# Altium project PK_PCB_Projekt.PrjPCB
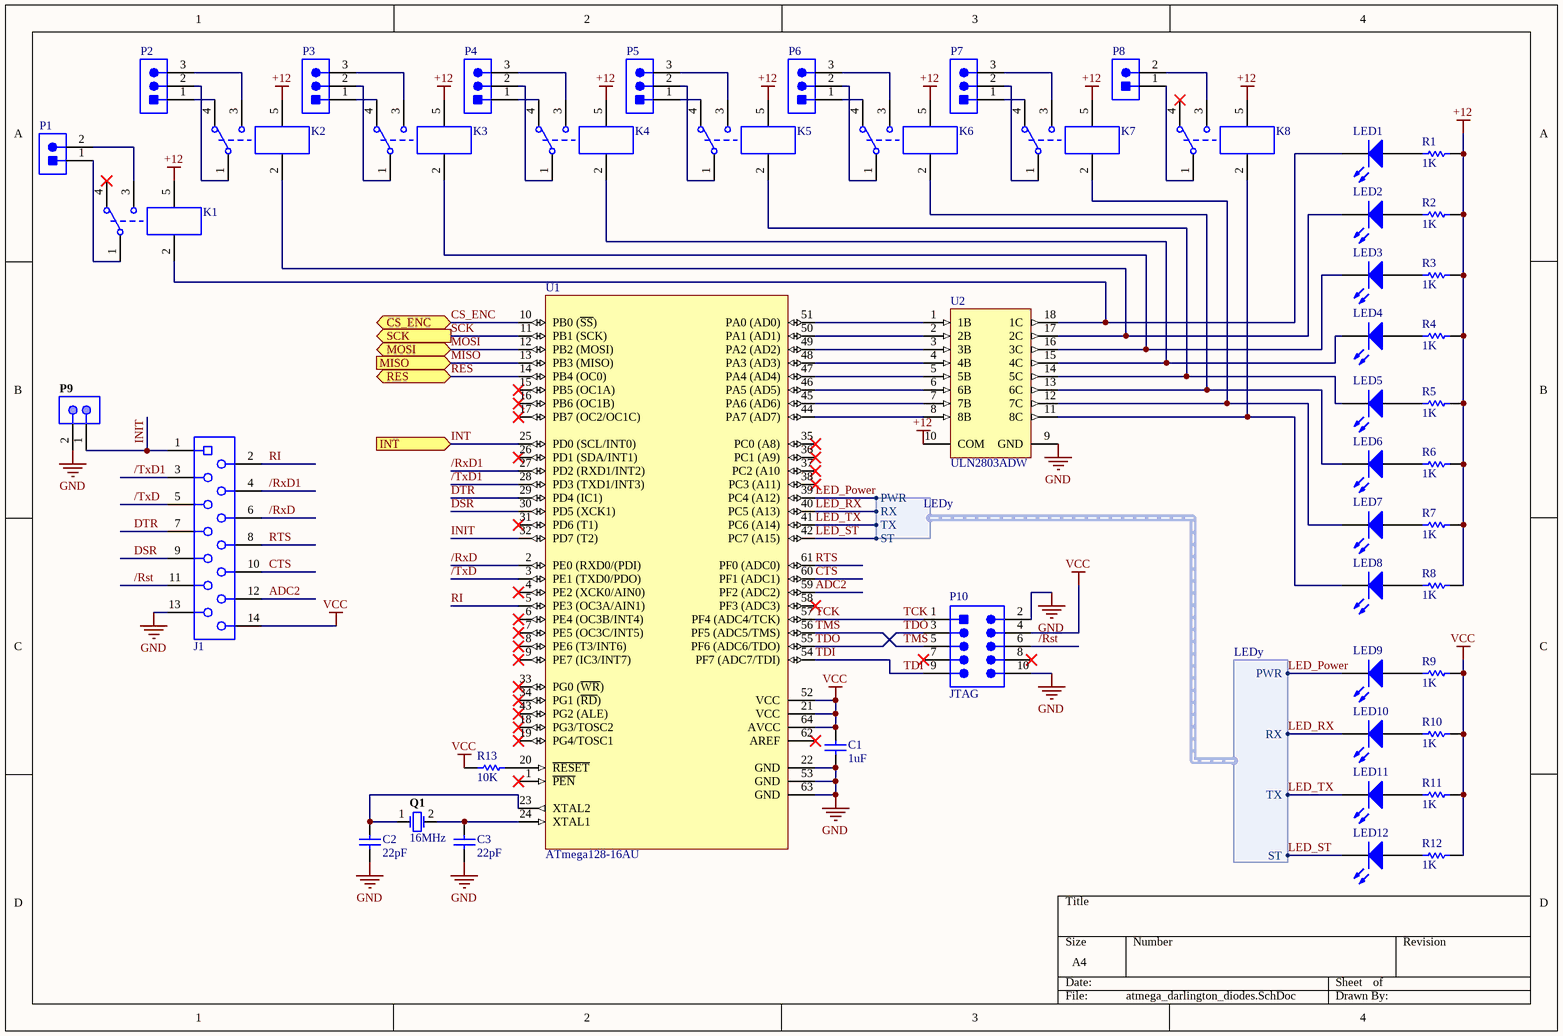
[diagram p0: atmega_darlington_diodes.SchDoc]
2 sheets, 84 parts. Net scope: flat (ports and power ports of the same name join across sheets).
Board file: PCB1.PcbDoc
Sheets:
  atmega_darlington_diodes.SchDoc
  ethernet_zasilanie.SchDoc

## Sheet atmega_darlington_diodes.SchDoc
size A4

### Parts
C1  1uF  [CAPC1206(3216)130_L]
C2  22pF  [CAPC1206(3216)100_L]
C3  22pF  [CAPC1206(3216)100_L]
J1  490107671412  [490107671412]  (value not drawn)
K1  JS1-12V  [PNSC-JS1-12V_V]  (value not drawn)
K2  JS1-12V  [PNSC-JS1-12V_V]  (value not drawn)
K3  JS1-12V  [PNSC-JS1-12V_V]  (value not drawn)
K4  JS1-12V  [PNSC-JS1-12V_V]  (value not drawn)
K5  JS1-12V  [PNSC-JS1-12V_V]  (value not drawn)
K6  JS1-12V  [PNSC-JS1-12V_V]  (value not drawn)
K7  JS1-12V  [PNSC-JS1-12V_V]  (value not drawn)
K8  JS1-12V  [PNSC-JS1-12V_V]  (value not drawn)
LED1  150120YS75000  [1206_A]  (value not drawn)
LED2  150120YS75000  [1206_A]  (value not drawn)
LED3  150120YS75000  [1206_A]  (value not drawn)
LED4  150120YS75000  [1206_A]  (value not drawn)
LED5  150120YS75000  [1206_A]  (value not drawn)
LED6  150120YS75000  [1206_A]  (value not drawn)
LED7  150120YS75000  [1206_A]  (value not drawn)
LED8  150120YS75000  [1206_A]  (value not drawn)
LED9  150120BS75000  [1206_A]  (value not drawn)
LED10  150120GS75000  [1206_A]  (value not drawn)
LED11  150120YS75000  [1206_A]  (value not drawn)
LED12  150120RS75000  [1206_A]  (value not drawn)
P1  SCREW-5.0/5.08 2WAYS  [SCREW-5.0-2WAYS_V]  (value not drawn)
P2  SCREW-5.0/5.08 3WAYS  [SCREW-5.0-3WAYS_V]  (value not drawn)
P3  SCREW-5.0/5.08 3WAYS  [SCREW-5.0-3WAYS_V]  (value not drawn)
P4  SCREW-5.0/5.08 3WAYS  [SCREW-5.0-3WAYS_V]  (value not drawn)
P5  SCREW-5.0/5.08 3WAYS  [SCREW-5.0-3WAYS_V]  (value not drawn)
P6  SCREW-5.0/5.08 3WAYS  [SCREW-5.0-3WAYS_V]  (value not drawn)
P7  SCREW-5.0/5.08 3WAYS  [SCREW-5.0-3WAYS_V]  (value not drawn)
P8  SCREW-5.0/5.08 2WAYS  [SCREW-5.0-2WAYS_V]  (value not drawn)
P9  PH2541-2-SPGRH-6-3  [PH2541-2-SPGRH-6-3_V]  (value not drawn)
P10  JTAG  [3M-2510-6002_V]
Q1  16MHz  [JPY-HC-49US]
R1  1K  [RESC1206(3216)_L]
R2  1K  [RESC1206(3216)_L]
R3  1K  [RESC1206(3216)_L]
R4  1K  [RESC1206(3216)_L]
R5  1K  [RESC1206(3216)_L]
R6  1K  [RESC1206(3216)_L]
R7  1K  [RESC1206(3216)_L]
R8  1K  [RESC1206(3216)_L]
R9  1K  [RESC1206(3216)_L]
R10  1K  [RESC1206(3216)_L]
R11  1K  [RESC1206(3216)_L]
R12  1K  [RESC1206(3216)_L]
R13  10K  [RESC1206(3216)_L]
U1  ATmega128-16AU  [64A_L]
U2  ULN2803ADW  [DW0018A_L]

### Ports
CS_ENC (bidir), INT (in), MISO (in), MOSI (bidir), RES (bidir), SCK (out)

### Harnesses
LEDy: PWR, RX, TX, ST

### Nets
+12: K1.5 K2.5 K3.5 K4.5 K5.5 K6.5 K7.5 K8.5 R1.2 R2.2 R3.2 R4.2 R5.2 R6.2 R7.2 R8.2 U2.10(COM)
GND: C1.1 C2.1 C3.1 J1.13 P9.2 P10.2 P10.10 U1.22(GND) U1.53(GND) U1.63(GND) U2.9(GND)
VCC: C1.2 J1.14 P10.4 R9.2 R10.2 R11.2 R12.2 R13.1 U1.21(VCC) U1.52(VCC) U1.64(AVCC)
/Rst: J1.11 P10.6
/RxD: J1.6 U1.2(PE0_(RXD0/(PDI))
/RxD1: J1.4 U1.27(PD2_(RXD1/INT2))
/TxD: J1.5 U1.3(PE1_(TXD0/PDO))
/TxD1: J1.3 U1.28(PD3_(TXD1/INT3))
ADC2: J1.12 U1.59(PF2_(ADC2))
CS_ENC: U1.10(PB0_(~{SS})) ; port CS_ENC
CTS: J1.10 U1.60(PF1_(ADC1))
DSR: J1.9 U1.30(PD5_(XCK1))
DTR: J1.7 U1.29(PD4_(IC1))
INIT: J1.1 P9.1 U1.32(PD7_(T2))
INT: U1.25(PD0_(SCL/INT0)) ; port INT
LED_Power: LED9.1(K) U1.39(PC4_(A12)) ; harness LEDy.PWR
LED_RX: LED10.1(K) U1.40(PC5_(A13)) ; harness LEDy.RX
LED_ST: LED12.1(K) U1.42(PC7_(A15)) ; harness LEDy.ST
LED_TX: LED11.1(K) U1.41(PC6_(A14)) ; harness LEDy.TX
MISO: U1.13(PB3_(MISO)) ; port MISO
MOSI: U1.12(PB2_(MOSI)) ; port MOSI
RES: U1.14(PB4_(OC0)) ; port RES
RI: J1.2 U1.5(PE3_(OC3A/AIN1))
RTS: J1.8 U1.61(PF0_(ADC0))
SCK: U1.11(PB1_(SCK)) ; port SCK
TCK: P10.1 U1.57(PF4_(ADC4/TCK))
TDI: P10.9 U1.54(PF7_(ADC7/TDI))
TDO: P10.3 U1.55(PF6_(ADC6/TDO))
TMS: P10.5 U1.56(PF5_(ADC5/TMS))
NetC2_2: C2.2 Q1.1 U1.23(XTAL2)
NetC3_2: C3.2 Q1.2 U1.24(XTAL1)
NetK1_1: K1.1(COM) P1.1
NetK1_2: K1.2 LED1.1(K) U2.18(1C)
NetK1_3: K1.3(N.O.) P1.2
NetK2_1: K2.1(COM) P2.2
NetK2_2: K2.2 LED2.1(K) U2.17(2C)
NetK2_3: K2.3(N.O.) P2.3
NetK2_4: K2.4(N.C.) P2.1
NetK3_1: K3.1(COM) P3.2
NetK3_2: K3.2 LED3.1(K) U2.16(3C)
NetK3_3: K3.3(N.O.) P3.3
NetK3_4: K3.4(N.C.) P3.1
NetK4_1: K4.1(COM) P4.2
NetK4_2: K4.2 LED4.1(K) U2.15(4C)
NetK4_3: K4.3(N.O.) P4.3
NetK4_4: K4.4(N.C.) P4.1
NetK5_1: K5.1(COM) P5.2
NetK5_2: K5.2 LED5.1(K) U2.14(5C)
NetK5_3: K5.3(N.O.) P5.3
NetK5_4: K5.4(N.C.) P5.1
NetK6_1: K6.1(COM) P6.2
NetK6_2: K6.2 LED6.1(K) U2.13(6C)
NetK6_3: K6.3(N.O.) P6.3
NetK6_4: K6.4(N.C.) P6.1
NetK7_1: K7.1(COM) P7.2
NetK7_2: K7.2 LED7.1(K) U2.12(7C)
NetK7_3: K7.3(N.O.) P7.3
NetK7_4: K7.4(N.C.) P7.1
NetK8_1: K8.1(COM) P8.1
NetK8_2: K8.2 LED8.1(K) U2.11(8C)
NetK8_3: K8.3(N.O.) P8.2
NetLED1_2: LED1.2(A) R1.1
NetLED2_2: LED2.2(A) R2.1
NetLED3_2: LED3.2(A) R3.1
NetLED4_2: LED4.2(A) R4.1
NetLED5_2: LED5.2(A) R5.1
NetLED6_2: LED6.2(A) R6.1
NetLED7_2: LED7.2(A) R7.1
NetLED8_2: LED8.2(A) R8.1
NetLED9_2: LED9.2(A) R9.1
NetLED10_2: LED10.2(A) R10.1
NetLED11_2: LED11.2(A) R11.1
NetLED12_2: LED12.2(A) R12.1
NetR13_2: R13.2 U1.20(~{RESET})
NetU1_44: U1.44(PA7_(AD7)) U2.8(8B)
NetU1_45: U1.45(PA6_(AD6)) U2.7(7B)
NetU1_46: U1.46(PA5_(AD5)) U2.6(6B)
NetU1_47: U1.47(PA4_(AD4)) U2.5(5B)
NetU1_48: U1.48(PA3_(AD3)) U2.4(4B)
NetU1_49: U1.49(PA2_(AD2)) U2.3(3B)
NetU1_50: U1.50(PA1_(AD1)) U2.2(2B)
NetU1_51: U1.51(PA0_(AD0)) U2.1(1B)

Not connected (* = marked no-connect by the designer): K1 4(N.C.)*; K8 4(N.C.)*; P10 7* 8*; U1 1(~{PEN})* 4(PE2_(XCK0/AIN0))* 6(PE4_(OC3B/INT4))* 7(PE5_(OC3C/INT5))* 8(PE6_(T3/INT6))* 9(PE7_(IC3/INT7))* 15(PB5_(OC1A))* 16(PB6_(OC1B))* 17(PB7_(OC2/OC1C))* 18(PG3/TOSC2)* 19(PG4/TOSC1)* 26(PD1_(SDA/INT1))* 31(PD6_(T1))* 33(PG0_(~{WR}))* 34(PG1_(~{RD}))* 35(PC0_(A8))* 36(PC1_(A9))* 37(PC2_(A10)* 38(PC3_(A11))* 43(PG2_(ALE))* 58(PF3_(ADC3))* 62(AREF)*

### Library data of the parts
C1 = CMP-1037-04671-1: CAP 1uF 10V ±5% 1206 (3216 Metric) Thickness 1.3mm SMD; Case-EIA: 1206; Tolerance: Â±5%; Case-Metric: 3216; Value: 1uF; Technology: SMT; Rated Voltage: 10 V; Max Thickness: 1.3 mm
C2 C3 = CMP-1037-00952-1: CAP 22pF 10V ±0.25pF 1206 (3216 Metric) Thickness 1mm SMD; Tolerance: Â±0.25pF; Case-EIA: 1206; Case-Metric: 3216; Rated Voltage: 10 V; Technology: SMT; Max Thickness: 1 mm; Value: 22pF
J1 = CMP-1502-02453-1: REDFIT IDC SKEDD Connector WR-WST, pitch 2.54 mm, 14 pins; Manufacturer: Wurth Elektronik; Pin Number: 14; Pitch: 2.54mm; Contact Resistance: 10mOhm; Rated Current: 1A; Working Voltage: 500VAC; PCB Thickness: 1.6mm; Part Number: 490107671412; Package Reference: 490107671412; Operating Temperature: -25to105degC; Publisher: WurthElektronik; Manufacturer URL: http://www.we-online.de; Packaging: Tube; Mounting Technology: Plug-in; Datasheet URL: https://katalog.we-online.de/em/datasheet/490107671412.pdf
K1-K8 = CMP-2000-06502-1: Cubic Type 1C Power Relay, SPDT, 10 A, 12 V, -40 to 70 degC, 5-Pin THD, RoHS, Bulk; Manufacturer: Panasonic; Material, contact: Silveralloy; Current, switch max: 10A; External Width: 22mm; Contact Voltage DC Nom: 100V; Power, coil DC: 360mW; Coil operating upper percent limit: 130%; Coil Resistance: 400ohm; Relay Mounting: ThroughHole; Coil Type: DC; External Height: 16mm; Coil Current: 30mA; Resistance, coil: 400R; Approval Bodies: UL&CSA,TUV; Voltage, switching AC/DC min: 277Vac; Voltage, contact AC max: 125V; Time, operating: 10ms; Current, contact min: 6A@277Vac; Coil Voltage VDC Nom: 12V; Configuration, contact: SPCO; Contact Voltage AC Nom: 277V; Temperature, operating (a) max: 70°C; Temperature, operating (a) min: -40°C; Coil operating lower percent limit: 70%; Width, external: 16.4mm; Current, contact AC max: 10A; Relay Type: Power; External Depth: 22mm; Package Reference: JS1-12V; Mounting Technology: ThroughHole; Diameter, PCB hole: 1.3mm; Depth, external: 16.4mm; Length / Height, external: 22mm; Nom Operating Power: 360mW; Time, release: 10ms; Datasheet URL: https://www3.panasonic.biz/ac/e_download/control/relay/power/catalog/mech_eng_js.pdf; Voltage, coil DC nom: 12V; Contact Current Max: 10A; Manufacturer URL: http://www.panasonic.com/; Contact Configuration: SPDT; Package Description: 5-Pin Through Hole Device, Body 22 x 16 mm; Datasheet Version: 12/2016
LED1-LED8 LED11 = CMP-1426-00019-1: SMD mono-color Chip LED, WL-SMCW, Yellow; Manufacturer: Wuerth Elektronik; ComponentLink2URL: http://katalog.we-online.com/led/datasheet/150120YS75000.pdf; PartNumber: 150120YS75000; ComponentLink1URL: http://www.we-online.com; Color: Yellow; ComponentLink1Description: Manufacturer URL; PackageReference: 1206_A; ComponentLink2Description: Datasheet
LED9 = CMP-1426-00015-1: SMD mono-color Chip LED, WL-SMCW, Blue; Manufacturer: Wuerth Elektronik; ComponentLink2Description: Datasheet; ComponentLink1URL: http://www.we-online.com; PartNumber: 150120BS75000; ComponentLink1Description: Manufacturer URL; ComponentLink2URL: http://katalog.we-online.com/led/datasheet/150120BS75000.pdf; PackageReference: 1206_A; Color: Blue
LED10 = CMP-1426-00014-1: SMD mono-color Chip LED, WL-SMCW, Green; Manufacturer: Wuerth Elektronik; PackageReference: 1206_A; PartNumber: 150120GS75000; ComponentLink1Description: Manufacturer URL; ComponentLink2URL: http://katalog.we-online.com/led/datasheet/150120GS75000.pdf; ComponentLink2Description: Datasheet; Color: Green; ComponentLink1URL: http://www.we-online.com
LED12 = CMP-1426-00013-1: SMD mono-color Chip LED, WL-SMCW, Red; Manufacturer: Wuerth Elektronik; Color: Red; ComponentLink2URL: http://katalog.we-online.com/led/datasheet/150120RS75000.pdf; ComponentLink2Description: Datasheet; ComponentLink1Description: Manufacturer URL; ComponentLink1URL: http://www.we-online.com; PartNumber: 150120RS75000; PackageReference: 1206_A
P1 P8 = CMP-0617-00009-1: Socket, Screw Terminal Block, 2 Way, 5.0 mm Pitch, 90 Degree Angle, Through-Hole; Manufacturer: No Vendor; Insulation Resistance: 5000 MOhm / 1000 V; Contact Resistance: 20 mOhm; Rated Current: 25 A; Poles: 2; Rated Voltage: 300 V; PartNumber: SCREW-5.0/5.08 2WAYS; ComponentLink1Description: Datasheet; ComponentLink1URL: 5mm screw terminal in SVN; Mounting Technology: Through Hole; PackageDescription: Socket, Screw Terminal Block, 2 Way, Pitch 5 mm, 90 Degree Angle, Through-Hole; Temperature Range: -40 to 105 degC
P2-P7 = CMP-0617-00010-1: Socket, Screw Terminal Block, 3 Way, 5.0 mm Pitch, 90 Degree Angle, Through-Hole; Manufacturer: No Vendor; Insulation Resistance: 5000 MOhm / 1000 V; Rated Voltage: 300 V; Poles: 3; Contact Resistance: 20 mOhm; Rated Current: 25 A; PartNumber: SCREW-5.0/5.08 3WAYS; PackageDescription: Socket, Screw Terminal Block, 3 Way, Pitch 5 mm, 90 Degree Angle, Through-Hole; Temperature Range: -40 to 105 degC; ComponentLink1Description: Datasheet; ComponentLink1URL: 5mm screw terminal in SVN; Mounting Technology: Through Hole
P9 = CMP-0261-00001-1: Male Header, Pitch 2.54mm, 2x1 Position, Mated Height 6mm, Tail Length 3mm; PackageDescription: 2-Pin Male Header IDC, 2.54 x 5.08 mm Body, 2.54 mm Pitch; PartNumber: PH2541-2-SPGRH-6-3; ComponentLink1URL: http://www.suzhoupinchao.com/; Mounting Technology: Through Hole; ComponentLink1Description: Manufacturer URL; PackageReference: PH2541-2-SPGRH-6-3
P10 = CMP-2000-05545-1: Male Header, Pitch 2.54 mm, 2 x 5 Position, Height 9.91 mm, Tail Length 2.84 mm, -55 to 105 degC, RoHS, Bulk; Manufacturer: 3M; Associated Product: 3505-33(1000BX)-ND / -CONNEJECTORLATCHLONGSNAP-IN; Pitch: 0.100"(2.54mm); Catalog Drawings: 6002UB,RBSeries; Dynamic Catalog: 2500Series; Connector Type: Header,Shrouded; Other Names: 5400782713 / 54007827139 / 80-6105-6503-0 / 80610565030 / MHB10G / MHB10K; Product Training Modules: IDCWiremountConnectorsPrimer; Number of Positions Loaded: All; Mating Products: CHG-2010-S01010-KEP-ND / -CONNRCPTIDC10POS24-22AWG / 3M11964-ND / -CONNSOCKET10POSIDCW/STRREL / 89110-0003-ND / -CONNSOCKET10POSIDCW/STRREL / 5110-B7A2PL-ND / -10/2R/BMSKT/.100 / MKC10E-ND / -CONN10POSIDCSOCKET10AUW/POL / MSC10E-ND / -CONN10POSIDCSOCKET15GOLD / D89110-0101HK-ND / -CONN10POSIDCSOCKETGOLDW/POL / D89110-0001HK-ND / -CONN10POSIDCSOCKETGOLD / MSPV10-ND / -CONNSOCKETPCBVERT10POS.1" / 3M9088-ND / -CONNRECEPTIDC10POS24-22AWG / More...; Number of Positions: 10; Category: Connectors,Interconnects; Datasheet Version: Rev. M, 08/2014; Datasheet URL: http://multimedia.3m.com/mws/media/330367O/3mtm-100-in-4-wall-hdr-rohs-lp-straightra-hitemp-ts0770.pdf; Series: 2500; Contact Finish: Gold; Number of Rows: 2; Standard Package: 784; Color: Gray; Package Description: Male Header, Pitch 2.54 mm, 2 x 5 Position, Height 9.91 mm, Tail Length 2.84 mm; Packaging: Bulk; Contact Type: MalePin; Mounting Technology: ThroughHole; Family: RectangularConnectors-Headers,MalePins; Contact Mating Length: 0.243"(6.17mm); Termination: Solder; Row Spacing: 0.100"(2.54mm); Package Reference: 2510-6002; Contact Finish Thickness: 30µin(0.76µm); Mounting Type: ThroughHole; Manufacturer URL: http://www.3m.com/
Q1 = CMP-2100-03645-1: Crystal, 16 MHz, +/- 30 ppm, 18 pF, -20 to 70 degC, 2-Pin THD; Manufacturer: Jing peng yuan; Datasheet URL: https://statics3.seeedstudio.com/images/opl/datasheet/306010014.pdf; Package Description: 2-Pin Throug Hole Device, Body 11.05 x 4.65 mm, Pitch 4.9 mm; Datasheet Version: 42125.0; Package Reference: HC-49US
R1-R12 = CMP-1014-00510-1: 1K 0.25W 1% 1206 (3216 Metric)  SMD; Case-Metric: 3216; Case-EIA: 1206; Value: 1000.00 Ohm; Power: 0.25 W; Tolerance: 1 %; Technology: SMT
R13 = CMP-1014-00623-1: 10K 0.25W 1% 1206 (3216 Metric)  SMD; Case-Metric: 3216; Value: 10000.00 Ohm; Case-EIA: 1206; Power: 0.25 W; Technology: SMT; Tolerance: 1 %
U1 = CMP-0095-00653-1: 8-bit AVR Microcontroller, 4.5-5.5V, 128KB Flash, 4KB EEPROM, 4KB SRAM, 64-pin TQFP, Industrial Grade (-40°C to 85°C), Reel; ComponentLink2URL: http://www.atmel.com/dyn/resources/prod_documents/doc2467.pdf; PackageVersion: revC, Oct-2010; ComponentLink3Description: ATmega128(L) Summary; PackageDescription: 64-Pin Plastic Thin Profile Quad Flat Pack, 14 x 14 x 1.0 mm Body, 0.8 mm Pitch (TQFP); ComponentLink1URL: http://www.atmel.com/; PackageReference: 64A; ComponentLink1Description: Manufacturer URL; DatasheetVersion: revX, Jun-2011; ComponentLink3URL: http://www.atmel.com/dyn/resources/prod_documents/2467S.pdf; ComponentLink2Description: ATmega128(L) Datasheet; Code_JEDEC: MS-026-AEB
U2 = CMP-2000-07353-1: Darlington Transistor NPN, 50 V, 0.5 A, -40 to 85 degC, 18-Pin SOIC (DW), Green (RoHS & no Sb/Br), Tube; Manufacturer: Texas Instruments; Base Number: 2803; Package Version: 4040000-3/G, 01/2011; SVHC: NoSVHC(19-Dec-2012); Module Configuration: Eight; No. of Pins: 18; No. of Transistors: 8; Current Ic Continuous a Max: 500mA; Collector Emitter Voltage V(br)ceo: 50V; Id: 0.5A; Datasheet URL: http://www.ti.com/lit/ds/symlink/uln2803a.pdf; Package / Case: 18-SOIC; Operating Temperature Range: -40°Cto+85°C; Manufacturer URL: http://www.ti.com/; Package Reference: DW18; DC Collector Current: 500mA; Transistor Case Style: SOIC; Transistor Polarity: NPN; Operating Temperature Min: -40°C; Device Marking: ULN2803ADW; Datasheet Version: Rev. G, 01/2015; Package URL: http://www.ti.com/lit/ml/mpds172a/mpds172a.pdf; Operating Temperature Max: 85°C; Mounting Technology: SurfaceMount; MSL: MSL2-1year; Package Description: 18-Pin Plastic Small Outline, Body 11.55 x 7.5 mm, Pitch 1.27 mm

## Sheet ethernet_zasilanie.SchDoc
size A4
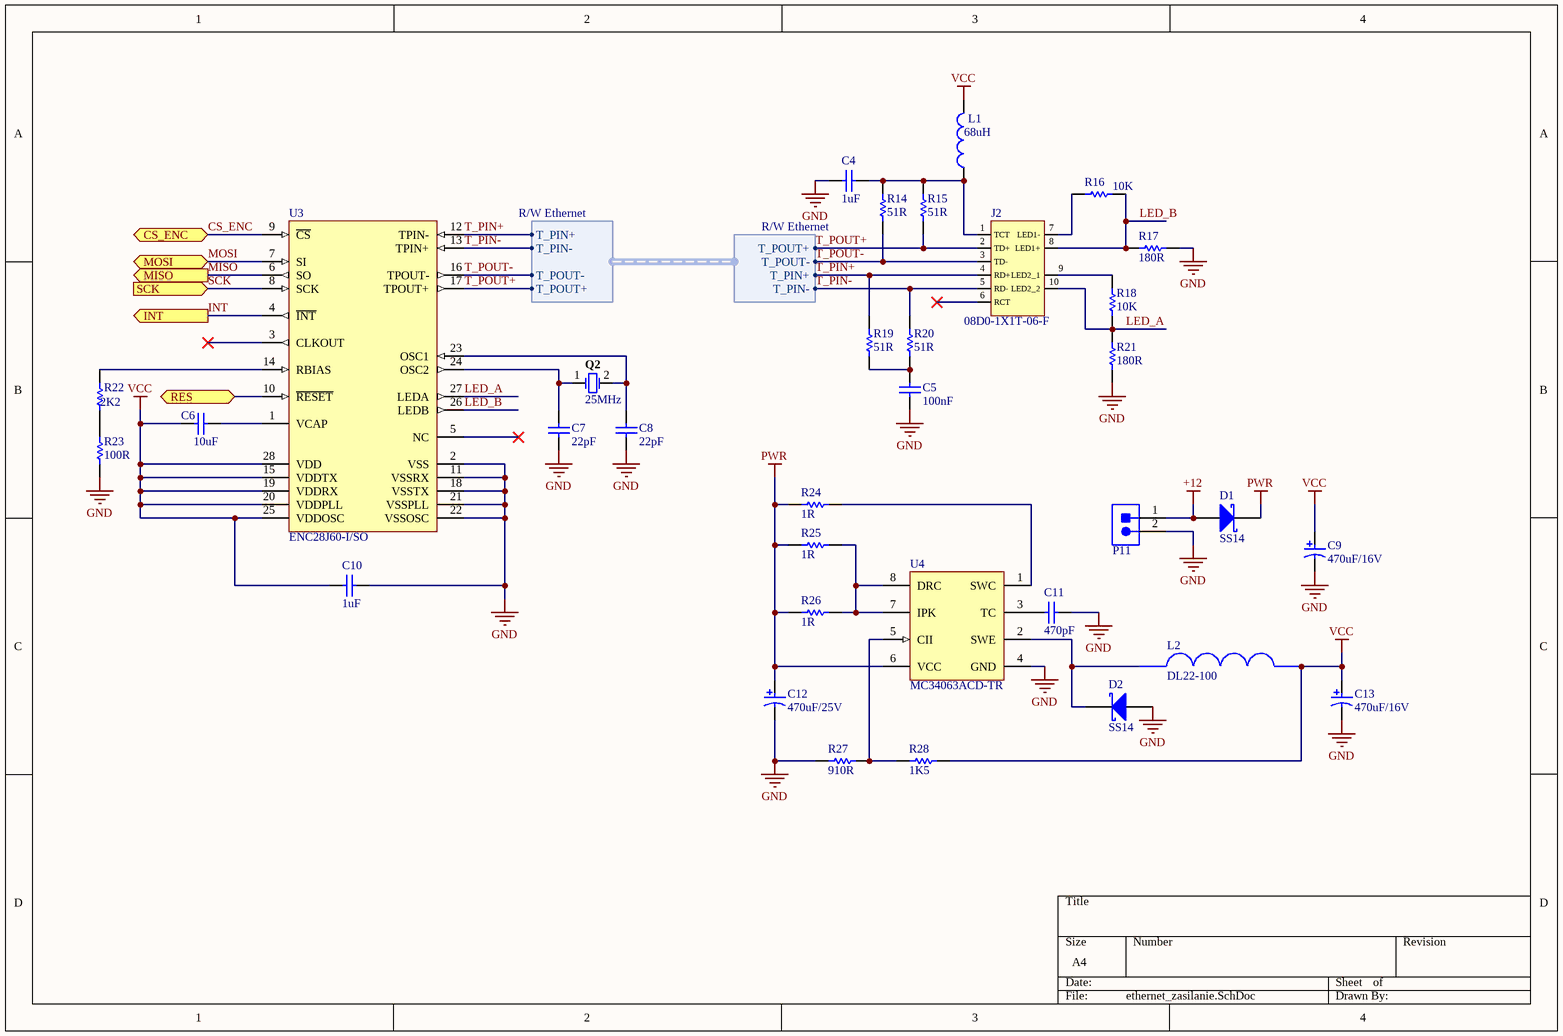
[diagram p1: ethernet_zasilanie.SchDoc]

### Parts
C4  1uF  [CAPC1206(3216)150_L]
C5  100nF  [CAPC1206(3216)190_L]
C6  10uF  [CAPC1206(3216)190_L]
C7  22pF  [CAPC1206(3216)100_L]
C8  22pF  [CAPC1206(3216)100_L]
C9  470uF/16V  [PNSC-FK-V-F_V]
C10  1uF  [CAPC1206(3216)130_L]
C11  470pF  [CAPC1206(3216)100_L]
C12  470uF/25V  [NIC-CAPA2-10X10_V]
C13  470uF/16V  [PNSC-FK-V-F_V]
D1  SS14  [FAIR-DO-214AC-2_V]
D2  SS14  [FAIR-DO-214AC-2_V]
J2  08D0-1X1T-06-F  [PCB_08D0-1X1T-06-F]
L1  value 68uH  [INDC1608L]  (hidden comment: Inductor)
L2  DL22-100  [DL22]
P11  SCREW-5.0/5.08 2WAYS  [SCREW-5.0-2WAYS_V]  (value not drawn)
Q2  25MHz  [JPY-HC-49US]
R14  51R  [RESC1206(3216)_L]
R15  51R  [RESC1206(3216)_L]
R16  10K  [RESC1206(3216)_L]
R17  180R  [RESC1206(3216)_L]
R18  10K  [RESC1206(3216)_L]
R19  51R  [RESC1206(3216)_L]
R20  51R  [RESC1206(3216)_L]
R21  180R  [RESC1206(3216)_L]
R22  2K2  [RESC1206(3216)_L]
R23  100R  [RESC1206(3216)_L]
R24  1R  [RESC1206(3216)_L]
R25  1R  [RESC1206(3216)_L]
R26  1R  [RESC1206(3216)_L]
R27  910R  [RESC1206(3216)_L]
R28  1K5  [RESC1206(3216)_L]
U3  ENC28J60-I/SO  [SOIC-SO28_L]
U4  MC34063ACD-TR  [SO8_L]

### Ports
CS_ENC (bidir), INT (out), MISO (out), MOSI (bidir), RES (bidir), SCK (in)

### Harnesses
R/W Ethernet: T_PIN+, T_PIN-, T_POUT-, T_POUT+
R/W Ethernet: T_POUT+, T_POUT-, T_PIN+, T_PIN-

### Nets
+12: D1.2(A) P11.1
GND: C4.1 C5.1 C7.1 C8.1 C9.2 C10.1 C11.2 C12.2 C13.2 D2.2(A) P11.2 R17.2 R21.1 R23.1 R27.1 U3.2(VSS) U3.11(VSSRX) U3.18(VSSTX) U3.21(VSSPLL) U3.22(VSSOSC) U4.4(GND)
PWR: C12.1 D1.1(K) R24.1 R25.1 R26.1 U4.6(VCC)
VCC: C6.1 C9.1 C10.2 C13.1 L1.2 L2.2 R28.2 U3.15(VDDTX) U3.19(VDDRX) U3.20(VDDPLL) U3.25(VDDOSC) U3.28(VDD)
CS_ENC: U3.9(~{CS}) ; port CS_ENC
INT: U3.4(~{INT}) ; port INT
LED_A: J2.10(LED2_2) R18.1 R21.2 U3.27(LEDA)
LED_B: J2.8(LED1+) R16.1 R17.1 U3.26(LEDB)
MISO: U3.6(SO) ; port MISO
MOSI: U3.7(SI) ; port MOSI
RES: U3.10(~{RESET}) ; port RES
SCK: U3.8(SCK) ; port SCK
T_PIN+: J2.4(RD+) R19.2 U3.12(TPIN-) ; harness R/W Ethernet.T_PIN+
T_PIN-: J2.5(RD-) R20.2 U3.13(TPIN+) ; harness R/W Ethernet.T_PIN-
T_POUT+: J2.2(TD+) R15.1 U3.17(TPOUT+) ; harness R/W Ethernet.T_POUT+
T_POUT-: J2.3(TD-) R14.1 U3.16(TPOUT-) ; harness R/W Ethernet.T_POUT-
NetC4_2: C4.2 J2.1(TCT) L1.1 R14.2 R15.2
NetC5_2: C5.2 R19.1 R20.1
NetC6_2: C6.2 U3.1(VCAP)
NetC7_2: C7.2 Q2.1 U3.24(OSC2)
NetC8_2: C8.2 Q2.2 U3.23(OSC1)
NetC11_1: C11.1 U4.3(TC)
NetD2_1: D2.1(K) L2.1 U4.2(SWE)
NetJ2_7: J2.7(LED1-) R16.2
NetJ2_9: J2.9(LED2_1) R18.2
NetR22_1: R22.1 R23.2
NetR22_2: R22.2 U3.14(RBIAS)
NetR24_2: R24.2 U4.1(SWC)
NetR25_2: R25.2 R26.2 U4.7(IPK) U4.8(DRC)
NetR27_2: R27.2 R28.1 U4.5(CII)

Not connected (* = marked no-connect by the designer): J2 6(RCT)*; U3 3(CLKOUT)* 5(NC)*

### Library data of the parts
C4 = CMP-1037-04667-1: CAP 1uF 6.3V ±5% 1206 (3216 Metric) Thickness 1.45mm SMD; Case-Metric: 3216; Tolerance: Â±5%; Case-EIA: 1206; Value: 1uF; Technology: SMT; Max Thickness: 1.45 mm; Rated Voltage: 6.3 V
C5 = CMP-1037-04169-1: CAP 100nF 10V ±1% 1206 (3216 Metric) Thickness 1.9mm SMD; Case-EIA: 1206; Tolerance: Â±1%; Case-Metric: 3216; Value: 100nF; Rated Voltage: 10 V; Max Thickness: 1.9 mm; Technology: SMT
C6 = CMP-1037-04960-1: CAP 10uF 6.3V ±5% 1206 (3216 Metric) Thickness 1.9mm SMD; Tolerance: Â±5%; Case-EIA: 1206; Case-Metric: 3216; Max Thickness: 1.9 mm; Value: 10uF; Technology: SMT; Rated Voltage: 6.3 V
C7 C8 = CMP-1037-00952-1: as C2 on sheet atmega_darlington_diodes; Rated Voltage: 10 V; Technology: SMT; Max Thickness: 1 mm; Value: 22pF
C9 C13 = CMP-2000-06204-1: Aluminum Electrolytic Capacitor, 470 uF, +/- 20%, 16 V, 2-Pin SMD (Size Code F), -55 to 105 degC, RoHS, Tape and Reel; Manufacturer: Panasonic; Capacitance: 470µF; Type: Can; Ripple Current: 600mA; Lifetime@Temperature: 2000Hrs@105°C; Impedance: 0.16O; Rated Voltage: 16V; Manufacturer URL: http://www.panasonic.com/; Package Description: 2-Pin Electrolytic Aluminum Capacitor, Body 8.3 x 8.3 mm; Operating Temp-Max: 105°C; Mounting Technology: SurfaceMount; Operating Temp Range: -55to+105°C; Datasheet Version: 03/2016; Series: FK; Package Reference: FK-V-F; Case Size/Dimension: Ø8x10.2mm; Package URL: http://industrial.panasonic.com/cdbs/www-data/pdf/RDE0000/DME0000COL48.pdf; Datasheet URL: http://industrial.panasonic.com/cdbs/www-data/pdf/RDE0000/ABA0000C1181.pdf
C10 = CMP-1037-04671-1: as C1 on sheet atmega_darlington_diodes; Value: 1uF; Technology: SMT; Rated Voltage: 10 V; Max Thickness: 1.3 mm
C11 = CMP-1037-02128-1: CAP 470pF 10V ±1% 1206 (3216 Metric) Thickness 1mm SMD; Case-EIA: 1206; Case-Metric: 3216; Tolerance: Â±1%; Technology: SMT; Value: 470pF; Max Thickness: 1 mm; Rated Voltage: 10 V
C12 = CMP-0687-00002-1: Aluminum Electrolytic Capacitor, UD Series, Low Impedance, 470 uF, 25 V, + / - 20%, -55 to 105 degC, Chip Type, 10 x 10 mm D x L, Pb-Free, Reel; PartNumber: UUD1E471MNL1GS; Manufacturer: Nichicon; Impedance: 0.09 Ohm; Endurance Time: 5000 h; Rated Ripple Current (at 100kHz): 670 mA; Rated Capacitance: 470 uF; Packing: Dia382mm Reel; Rated Voltage: 25 V; Tolerance Rated Capacitance: -20 to 20%; ComponentLink3URL: http://products.nichicon.co.jp/en/pdf/XJA043/e-ud.pdf; ComponentLink2URL: http://products.nichicon.co.jp/en/pdf/XJA043/e-ud.pdf; Length: 10 mm; ComponentLink3Description: Package Specification; PackageReference: CAPAE-D10H10; ComponentLink1URL: http://www.nichicon.co.jp/; DatasheetVersion: 08/2012; ComponentLink1Description: Manufacturer URL; ComponentLink2Description: Datasheet; Diameter: 10 mm; PackageDescription: 2-Pin Surface Mount Device, Diameter 10 mm, Height 10 mm, Pitch 8 mm; RoHS: TRUE; Mounting Technology: Surface Mount
D1 D2 = CMP-2000-04943-1: Schottky Rectifier, 1.1 W, -65 to 125 degC, 2-Pin SMD, RoHS, Tape and Reel; Manufacturer: Fairchild; Configuration: SINGLE; Diode Element Material: SILICON; Power Dissipation Limit-Max (W): 1.1; Additional Feature: FREEWHEELINGDIODE; Signal Diode Type: SIGNALDIODE; Number of Elements: 1; JEDEC-95 Code: DO-214AC; Rep Pk Reverse Voltage-Max (V): 40; Package Body Material: PLASTIC/EPOXY; CAGE Code: 1HBD3,07933,59621,7D893; Peak Reflow Temperature (Cel): 260; Package Shape: RECTANGULAR; Manufacturer URL: https://www.fairchildsemi.com/; JESD-97 Code: e3; Package Reference: DO-214AC-2; RoHS Compliant: YES; Package Description: 2-Pin Surface Mount Device, Body 4.375 x 2.725 mm; Technology: SCHOTTKY; Surface Mount: YES; Datasheet URL: http://www.onlinecomponents.com/datasheet/ss14.aspx?p=11369800; Terminal Form: CBEND; Package Style: SMALLOUTLINE; Number of Terminals: 2; JESD-30 Code: R-PDSO-C2; Average Forward Current-Max (A): 1; Terminal Finish: MATTETIN; Datasheet Version: Oct-13; Terminal Position: DUAL; Package URL: https://www.fairchildsemi.com/package-drawings/DO/DO214AC.pdf; Moisture Sensitivity Level: 1; Lead Free: YES
P11 = CMP-0617-00009-1: as P1 on sheet atmega_darlington_diodes; PartNumber: SCREW-5.0/5.08 2WAYS; ComponentLink1Description: Datasheet; ComponentLink1URL: 5mm screw terminal in SVN; Mounting Technology: Through Hole; PackageDescription: Socket, Screw Terminal Block, 2 Way, Pitch 5 mm, 90 Degree Angle, Through-Hole; Temperature Range: -40 to 105 degC
Q2 = CMP-2100-03645-1: Crystal, 25 MHz, +/- 30 ppm, 22 pF, -20 to 70 degC, 2-Pin THD; Manufacturer: Jing peng yuan; Datasheet URL: https://pl.mouser.com/datasheet/2/96/008-0308-0-1160929.pdf; Package Description: 2-Pin Throug Hole Device, Body 11.05 x 4.65 mm, Pitch 4.9 mm; Datasheet Version: 42125.0; Package Reference: HC-49U
R14 R15 R19 R20 = CMP-1014-00364-1: 51R 0.25W 1% 1206 (3216 Metric)  SMD; Value: 51.00 Ohm; Case-EIA: 1206; Case-Metric: 3216; Tolerance: 1 %; Technology: SMT; Power: 0.25 W
R16 R18 = CMP-1014-00623-1: as R13 on sheet atmega_darlington_diodes; Power: 0.25 W; Technology: SMT; Tolerance: 1 %
R17 R21 = CMP-1014-00424-1: 180R 0.25W 1% 1206 (3216 Metric)  SMD; Case-Metric: 3216; Value: 180.00 Ohm; Case-EIA: 1206; Tolerance: 1 %; Power: 0.25 W; Technology: SMT
R22 = CMP-1014-00546-1: 2K2 0.25W 1% 1206 (3216 Metric)  SMD; Value: 2200.00 Ohm; Case-Metric: 3216; Case-EIA: 1206; Power: 0.25 W; Technology: SMT; Tolerance: 1 %
R23 = CMP-1014-00397-1: 100R 0.25W 1% 1206 (3216 Metric)  SMD; Value: 100.00 Ohm; Case-Metric: 3216; Case-EIA: 1206; Technology: SMT; Tolerance: 1 %; Power: 0.25 W
R24-R26 = CMP-1014-00171-1: 1R 0.25W 1% 1206 (3216 Metric)  SMD; Case-EIA: 1206; Value: 1.00 Ohm; Case-Metric: 3216; Technology: SMT; Power: 0.25 W; Tolerance: 1 %
R27 = CMP-1014-00506-1: 910R 0.25W 1% 1206 (3216 Metric)  SMD; Case-Metric: 3216; Case-EIA: 1206; Value: 910.00 Ohm; Technology: SMT; Power: 0.25 W; Tolerance: 1 %
R28 = CMP-1014-00528-1: 1K5 0.25W 1% 1206 (3216 Metric)  SMD; Case-EIA: 1206; Case-Metric: 3216; Value: 1500.00 Ohm; Tolerance: 1 %; Technology: SMT; Power: 0.25 W
U3 = CMP-0186-00132-2: Stand-Alone Ethernet Controller with SPI Interface, 28-Pin SOIC, Industrial Temperature; Code_JEDEC: MS-013; ComponentLink2URL: http://ww1.microchip.com/downloads/en/DeviceDoc/39662c.pdf; PackageDescription: 28-Lead Plastic Small Outline (SO) - Wide 7.50mm Body [SOIC]; RevisionNote: URLs added.; ComponentLink2Description: Datasheet; ComponentLink1Description: Manufacturer URL; ComponentLink3Description: Package Specification; DatasheetVersion: revC, Jan-2008; ComponentLink1URL: http://www.microchip.com/; ComponentLink3URL: http://www.microchip.com/stellent/groups/techpub_sg/documents/packagingspec/en012702.pdf; PackageVersion: revBB, Aug-2009; PackageReference: SOIC-SO28
U4 = CMP-0241-00016-1: DC/DC converter control circuit, 8-Pin SO, Tape and Reel; Code_IPC: SOIC127P600-8; ComponentLink2Description: Datasheet; ComponentLink3Description: Package Specification; PackageDescription: 8-Pin Small Outline Integrated Circuit 1.27 mm Pitch; Code_JEDEC: MS-012-AA; ComponentLink3URL: http://www.st.com/internet/com/TECHNICAL_RESOURCES/TECHNICAL_LITERATURE/PACKAGE_INFORMATION/CD00004680.pdf; ComponentLink1Description: Manufacturer URL; ComponentLink1URL: http://www.st.com; DatasheetVersion: Nov-2007; ComponentLink2URL: http://www.st.com/internet/com/TECHNICAL_RESOURCES/TECHNICAL_LITERATURE/DATASHEET/CD00001232.pdf; PackageReference: SO8; PackageVersion: Dec-2002
J2 = 08D0-1X1T-06-F: supplier 1: Digi-Key; supplier part number 1: 507-1445-ND; helpurl: https://www.belfuse.com/resources/ICMs/ICMs%20Drawings/08B0-1X1T-06-F.pdf
L1 = Inductor: Published: 8-Jun-2000; Publisher: Altium Limited
L2 = DL22-100: supplier 1: TME; supplier part number 1: DL22-100; helpurl: https://www.tme.eu/pl/Document/6ba894df3330489656add27ab934f082/dl2250.pdf

## Nets that join several sheets
+12: atmega_darlington_diodes (17 pins), ethernet_zasilanie (D1.2 P11.1)
GND: atmega_darlington_diodes (11 pins), ethernet_zasilanie (21 pins)
VCC: atmega_darlington_diodes (11 pins), ethernet_zasilanie (12 pins)
CS_ENC: atmega_darlington_diodes (U1.10), ethernet_zasilanie (U3.9)
INT: atmega_darlington_diodes (U1.25), ethernet_zasilanie (U3.4)
MISO: atmega_darlington_diodes (U1.13), ethernet_zasilanie (U3.6)
MOSI: atmega_darlington_diodes (U1.12), ethernet_zasilanie (U3.7)
RES: atmega_darlington_diodes (U1.14), ethernet_zasilanie (U3.10)
SCK: atmega_darlington_diodes (U1.11), ethernet_zasilanie (U3.8)